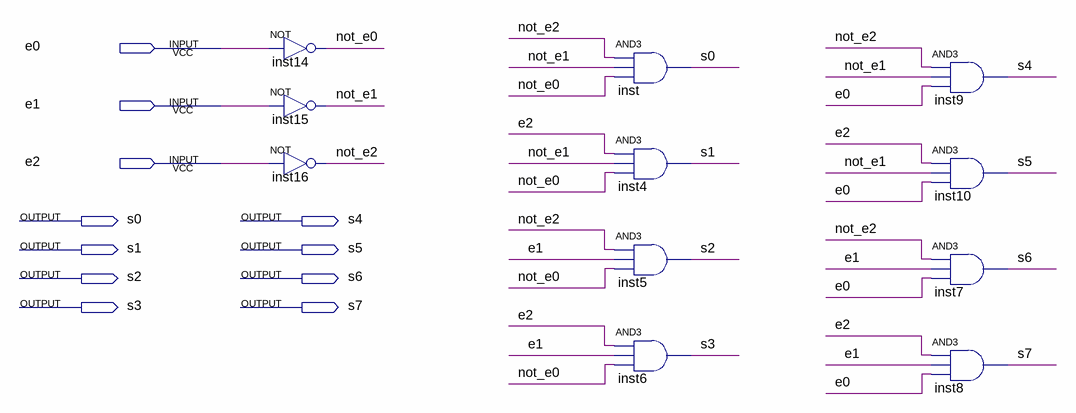
[diagram p0: schematic sheet]
// Quartus schematic mbr_decod3x8.bdf as structural Verilog: 11 symbols, 11 pins
module mbr_decod3x8 (
  input  e0,
  input  e1,
  input  e2,
  output s0,
  output s4,
  output s1,
  output s5,
  output s2,
  output s6,
  output s3,
  output s7
);

  wire not_e0, not_e1, not_e2;

  not inst14 (not_e0, e0);
  not inst15 (not_e1, e1);
  not inst16 (not_e2, e2);
  and inst (s0, not_e2, not_e1, not_e0);
  and inst4 (s1, e2, not_e1, not_e0);
  and inst5 (s2, not_e2, e1, not_e0);
  and inst6 (s3, e2, e1, not_e0);
  and inst9 (s4, not_e2, not_e1, e0);
  and inst10 (s5, e2, not_e1, e0);
  and inst7 (s6, not_e2, e1, e0);
  and inst8 (s7, e2, e1, e0);
endmodule
